# Altium schematic sheet IMU_REV_3.SchDoc: IMU For The CUBE
size A4; Author: Philip Rowse; CompanyName: ProfiCNC; DrawnBy: Philip Rowse; Organization: Proficnc; Address1: Black Hill; Address2: Ballarat; Address3: Victoria 3350; Address4: Australia; Revision: 3; SheetNumber: 1; SheetTotal: 1
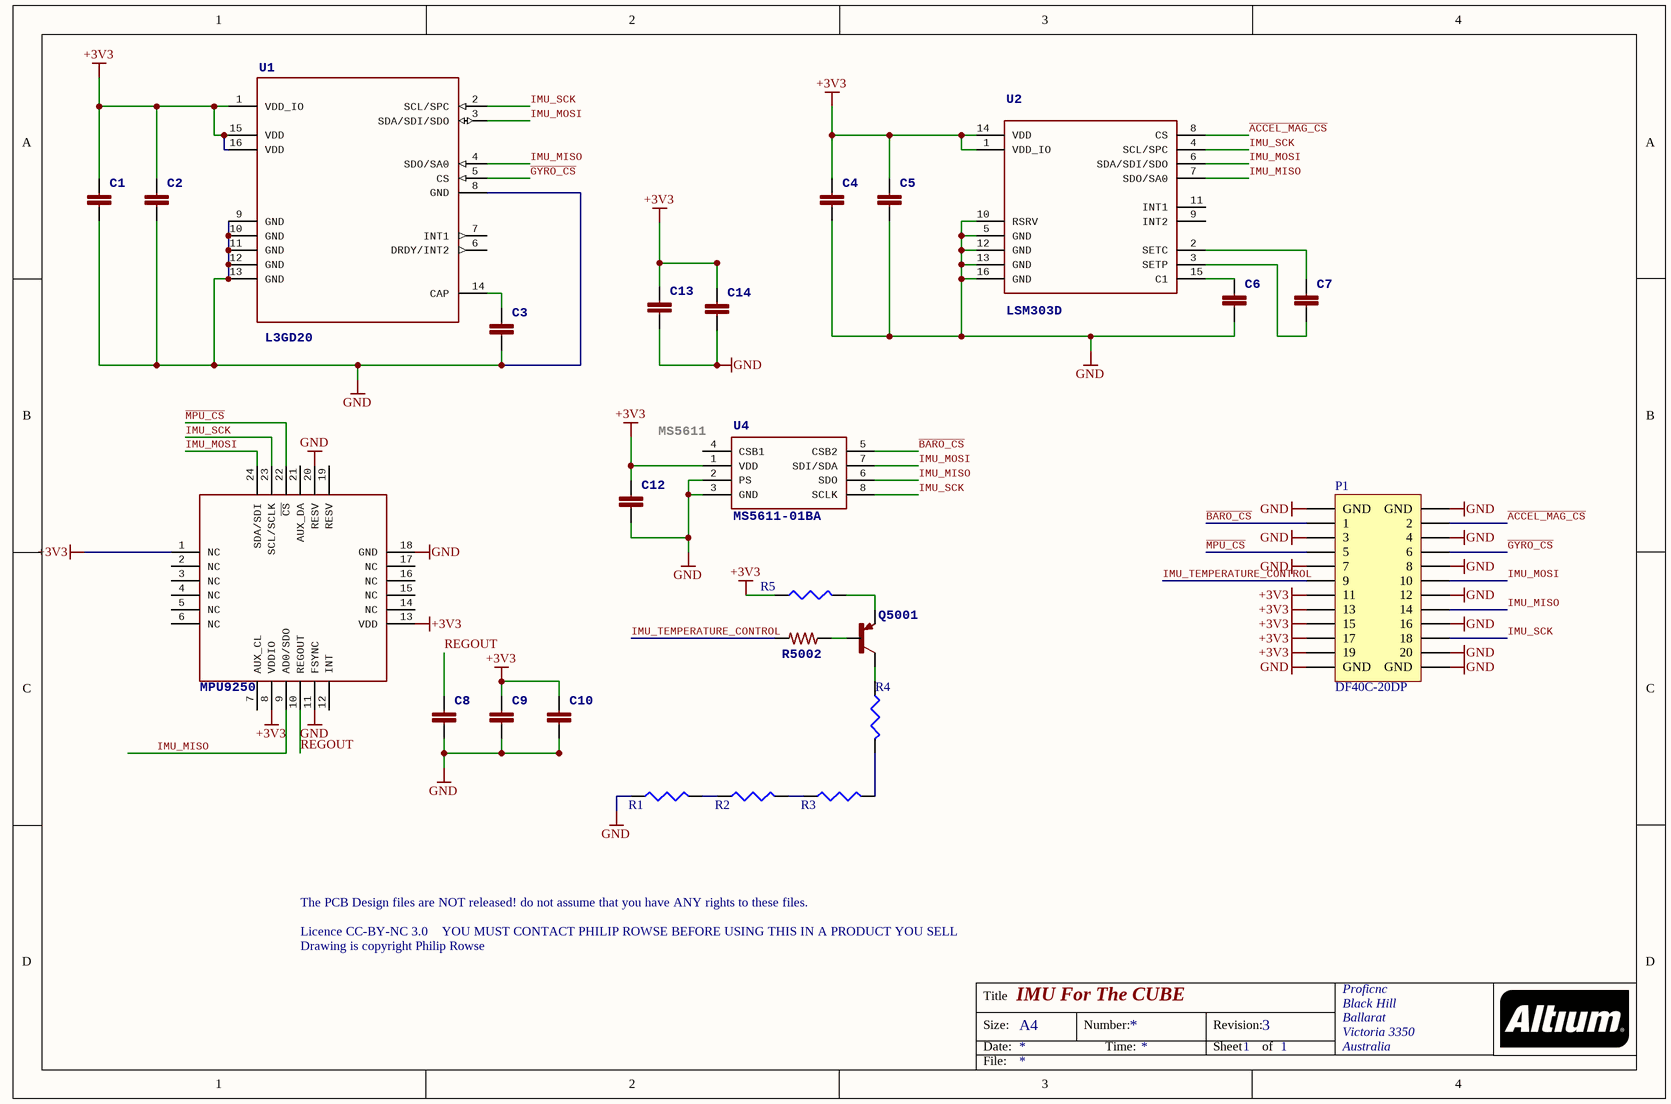
[diagram p0: IMU_REV_3.SchDoc]

## Parts
C1  (no value)
C2  (no value)
C3  (no value)
C4  (no value)
C5  (no value)
C6  (no value)
C7  (no value)
C8  (no value)
C9  (no value)
C10  (no value)
C12  (no value)
C13  (no value)
C14  (no value)
MPU9250  (no value)
P1  DF40C-20DP
Q5001  (no value)
R1  Resistor  (value not drawn)
R2  Resistor  (value not drawn)
R3  Resistor  (value not drawn)
R4  Resistor  (value not drawn)
R5  Resistor  (value not drawn)
R5002  (no value)
U1  L3GD20
U2  LSM303D
U4  MS5611-01BA

## Nets
+3V3: C1.P$1 C2.P$1 C4.P$1 C5.P$1 C9.P$1 C10.P$1 C12.P$1 C13.P$1 C14.P$1 MPU9250.1(NC) MPU9250.8(VDDIO) MPU9250.13(VDD) P1.11 P1.13 P1.15 P1.17 P1.19 R5.1 U1.1(VDD_IO) U1.15(VDD) U1.16(VDD) U2.1(VDD_IO) U2.14(VDD) U4.1(VDD)
GND: C1.P$2 C2.P$2 C3.P$2 C4.P$2 C5.P$2 C6.P$2 C8.P$2 C9.P$2 C10.P$2 C12.P$2 C13.P$2 C14.P$2 MPU9250.11(FSYNC) MPU9250.18(GND) MPU9250.20(RESV) P1.3 P1.4 P1.7 P1.8 P1.12 P1.16 P1.20 P1.21(GND) P1.22(GND) P1.23(GND) P1.24(GND) R1.1 U1.8(GND) U1.9(GND) U1.10(GND) U1.11(GND) U1.12(GND) U1.13(GND) U2.5(GND) U2.10(RSRV) U2.12(GND) U2.13(GND) U2.16(GND) U4.2(PS) U4.3(GND)
~{ACCEL_MAG_CS}: P1.2 U2.8(CS)
~{BARO_CS}: P1.1 U4.5(CSB2)
~{GYRO_CS}: P1.6 U1.5(CS)
IMU_MISO: MPU9250.9(AD0/SDO) P1.14 U1.4(SDO/SA0) U2.7(SDO/SA0) U4.6(SDO)
IMU_MOSI: MPU9250.24(SDA/SDI) P1.10 U1.3(SDA/SDI/SDO) U2.6(SDA/SDI/SDO) U4.7(SDI/SDA)
IMU_SCK: MPU9250.23(SCL/SCLK) P1.18 U1.2(SCL/SPC) U2.4(SCL/SPC) U4.8(SCLK)
IMU_TEMPERATURE_CONTROL: P1.9 R5002.P$2
~{MPU_CS}: MPU9250.22(~{CS}) P1.5
REGOUT: C8.P$1 MPU9250.10(REGOUT)
NetC3_P$1: C3.P$1 U1.14(CAP)
NetC6_P$1: C6.P$1 U2.15(C1)
NetC7_P$1: C7.P$1 U2.2(SETC)
NetC7_P$2: C7.P$2 U2.3(SETP)
NetQ5001_B: Q5001.B R5002.P$1
NetQ5001_C: Q5001.C R4.1
NetQ5001_E: Q5001.E R5.2
NetR1_2: R1.2 R2.1
NetR2_2: R2.2 R3.1
NetR3_2: R3.2 R4.2

Not connected (* = marked no-connect by the designer): MPU9250 2(NC) 3(NC) 4(NC) 5(NC) 6(NC) 7(AUX_CL) 12(INT) 14(NC) 15(NC) 16(NC) 17(NC) 19(RESV) 21(AUX_DA); U1 6(DRDY/INT2) 7(INT1); U2 9(INT2) 11(INT1); U4 4(CSB1)

## Notes on the sheet
- (near U4) MS5611
- The PCB Design files are NOT released! do not assume that you have ANY rights to these files.
- Licence CC-BY-NC 3.0    YOU MUST CONTACT PHILIP ROWSE BEFORE USING THIS IN A PRODUCT YOU SELL
- Drawing is copyright Philip Rowse
- Title
- Size:
- Date:
- A4
- Number:
- Time:
- Revision:
- Sheet
- of
- File:

## Library data of the parts
C1 C4 C6 C13 = CAPACITOR-0805
C2 C3 C5 C7 C10 C12 C14 = CAPACITOR-0402
C8 C9 = CAPACITOR-0603
MPU9250 = MPU-6500
Q5001 = MMBT3906*SMD
R5002 = RESISTOR0402-RES